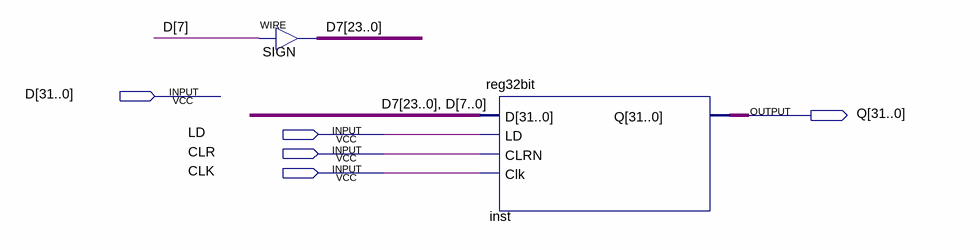
[diagram p0: schematic sheet]
// Quartus schematic reg32bit_upper8_signed.bdf as structural Verilog: 2 symbols, 5 pins
module reg32bit_upper8_signed (
  input  [31:0] D,
  input  LD,
  input  CLR,
  input  CLK,
  output [31:0] Q
);

  wire [23:0] D7;

  assign D7 = {24{D[7]}};  // WIRE SIGN
  reg32bit inst (.D({D7, D[7:0]}), .LD(LD), .CLRN(CLR), .Clk(CLK), .Q(Q));
endmodule
